# EAGLE design C64-Wifi_UserP (EAGLE 9.2.2)
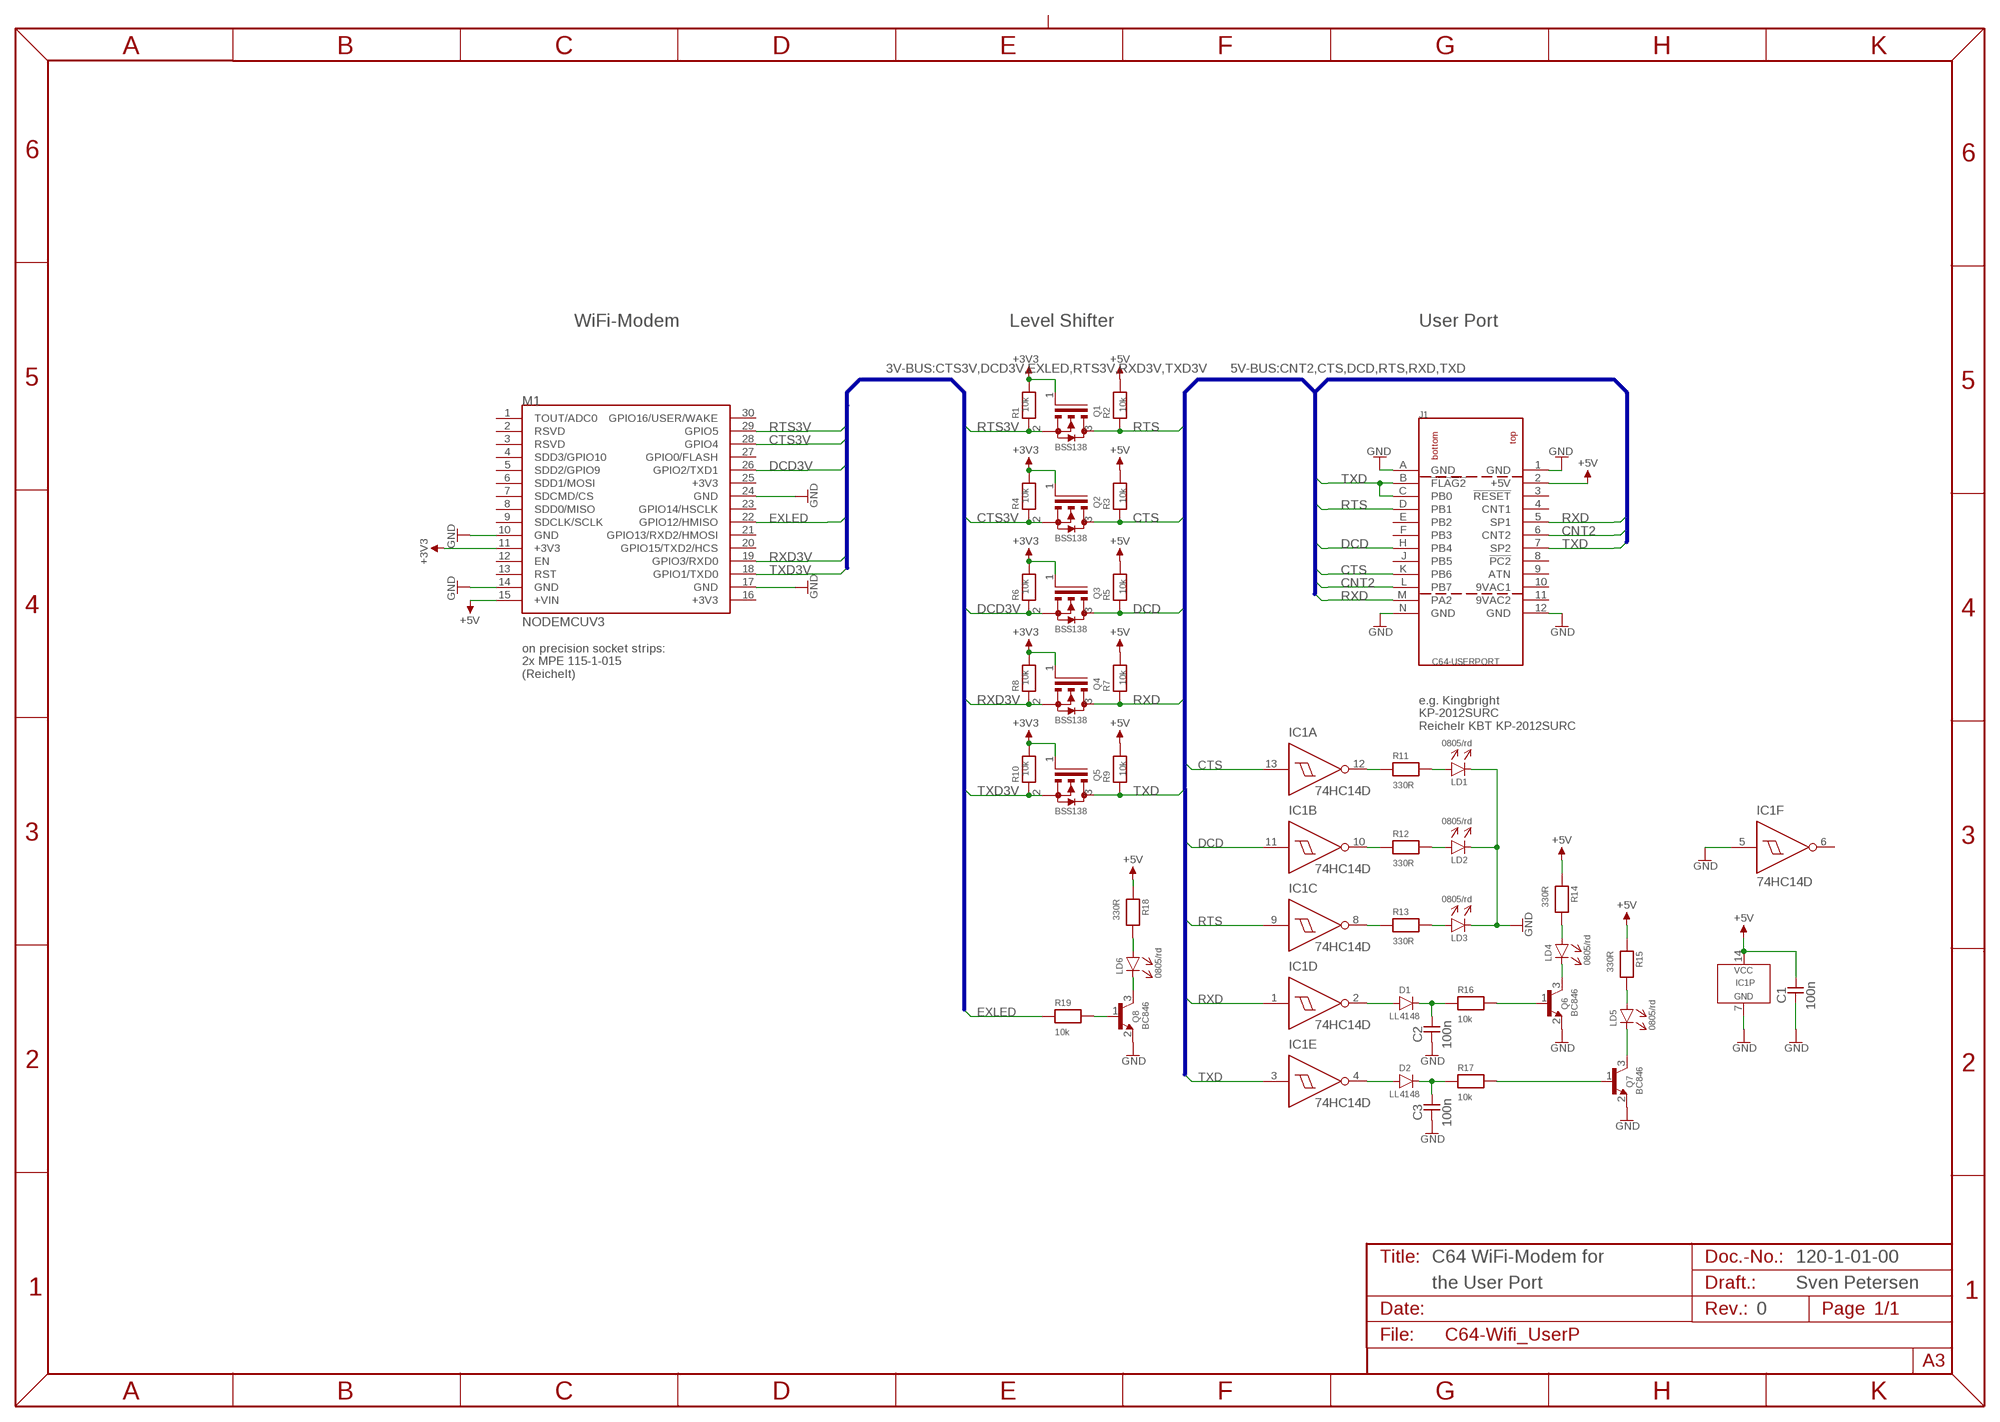
[diagram p0: schematic, sheet 1]

## Parts
C1  100n  C-0805  [0805]
C2  100n  C-0805  [0805]
C3  100n  C-0805  [0805]
D1  LL4148  [SOD80C]
D2  LL4148  [SOD80C]
IC1  74HC14D  7414  [SO-14]
J1  C64-USERPORT  [USERPORT]
LD1  0805/rd  0805-LED  [0805]
LD2  0805/rd  0805-LED  [0805]
LD3  0805/rd  0805-LED  [0805]
LD4  0805/rd  0805-LED  [0805]
LD5  0805/rd  0805-LED  [0805]
LD6  0805/rd  0805-LED  [0805]
M1  NODEMCUV3  [NODEMCUV3]
Q1  BSS138  [SOT23]
Q2  BSS138  [SOT23]
Q3  BSS138  [SOT23]
Q4  BSS138  [SOT23]
Q5  BSS138  [SOT23]
Q6  BC846  [SOT23]
Q7  BC846  [SOT23]
Q8  BC846  [SOT23]
R1  10k  R-0805  [0805]
R2  10k  R-0805  [0805]
R3  10k  R-0805  [0805]
R4  10k  R-0805  [0805]
R5  10k  R-0805  [0805]
R6  10k  R-0805  [0805]
R7  10k  R-0805  [0805]
R8  10k  R-0805  [0805]
R9  10k  R-0805  [0805]
R10  10k  R-0805  [0805]
R11  330R  R-0805  [0805]
R12  330R  R-0805  [0805]
R13  330R  R-0805  [0805]
R14  330R  R-0805  [0805]
R15  330R  R-0805  [0805]
R16  10k  R-0805  [0805]
R17  10k  R-0805  [0805]
R18  330R  R-0805  [0805]
R19  10k  R-0805  [0805]

## Nets
+3V3: M1.11(+3V3) Q1.1(G) Q2.1(G) Q3.1(G) Q4.1(G) Q5.1(G) R1.2 R4.2 R6.2 R8.2 R10.2
+5V: C1.2 IC1.14(P:VCC) J1.2(+5V) M1.15(+VIN) R2.2 R3.2 R5.2 R7.2 R9.2 R14.1 R15.1 R18.1
CNT2: J1.6(CNT2) J1.L(PB7)
CTS: IC1.13(A:I) J1.K(PB6) Q2.3(D) R3.1
CTS3V: M1.28(GPIO4) Q2.2(S) R4.1
DCD: IC1.11(B:I) J1.H(PB4) Q3.3(D) R5.1
DCD3V: M1.26(GPIO2/TXD1) Q3.2(S) R6.1
EXLED: M1.22(GPIO12/HMISO) R19.1
GND: C1.1 C2.1 C3.1 IC1.5(F:I) IC1.7(P:GND) J1.1(GND) J1.12(GND) J1.A(GND) J1.N(GND) LD1.K LD2.K LD3.K M1.10(GND) M1.14(GND) M1.17(GND) M1.24(GND) Q6.2(E) Q7.2(E) Q8.2(E)
N$1: IC1.12(A:O) R11.1
N$2: IC1.10(B:O) R12.1
N$3: IC1.8(C:O) R13.1
N$4: D1.A IC1.2(D:O)
N$5: D2.A IC1.4(E:O)
N$6: LD5.A R15.2
N$7: LD4.A R14.2
N$8: LD3.A R13.2
N$9: LD2.A R12.2
N$10: LD1.A R11.2
N$11: C2.2 D1.K R16.1
N$12: C3.2 D2.K R17.1
N$13: Q6.1(B) R16.2
N$14: Q7.1(B) R17.2
N$15: LD4.K Q6.3(C)
N$16: LD5.K Q7.3(C)
N$17: LD6.A R18.2
N$18: LD6.K Q8.3(C)
N$19: Q8.1(B) R19.2
RTS: IC1.9(C:I) J1.D(PB1) Q1.3(D) R2.1
RTS3V: M1.29(GPIO5) Q1.2(S) R1.1
RXD: IC1.1(D:I) J1.5(SP1) J1.M(PA2) Q4.3(D) R7.1
RXD3V: M1.19(GPIO3/RXD0) Q4.2(S) R8.1
TXD: IC1.3(E:I) J1.7(SP2) J1.B(!FLAG2) J1.C(PB0) Q5.3(D) R9.1
TXD3V: M1.18(GPIO1/TXD0) Q5.2(S) R10.1
Unconnected: IC1.6(F:O) J1.3(!RESET) J1.4(CNT1) J1.8(!PC2) J1.9(ATN) J1.E(PB2) J1.F(PB3) J1.J(PB5) M1.1(TOUT/ADC0) M1.2(RSVD) M1.3(RSVD) M1.4(SDD3/GPIO10) M1.5(SDD2/GPIO9) M1.6(SDD1/MOSI) M1.7(SDCMD/CS) M1.8(SDD0/MISO) M1.9(SDCLK/SCLK) M1.12(EN) M1.13(RST) M1.16(+3V3) M1.20(GPIO15/TXD2/HCS) M1.21(GPIO13/RXD2/HMOSI) M1.23(GPIO14/HSCLK) M1.25(+3V3) M1.27(GPIO0/FLASH) M1.30(GPIO16/USER/WAKE)

## Buses
3V-BUS:CTS3V,DCD3V,EXLED,RTS3V,RXD3V,TXD3V
5V-BUS:CNT2,CTS,DCD,RTS,RXD,TXD

## Notes on the sheet
- WiFi-Modem | Level Shifter | User Port
- on precision socket strips:
  2x MPE 115-1-015
  (Reichelt)
- e.g. Kingbright
  KP-2012SURC
  Reichelr KBT KP-2012SURC
- C64 WiFi-Modem for | 120-1-01-00
- the User Port | Sven Petersen
- 0

## Power pins joined to a net without a drawn wire
9VAC1: J1.10(9VAC1)
9VAC2: J1.11(9VAC2)

## Library data of the parts
C1-C3 = SMD:C-0805
D1 D2 = Dioden:LL4148
IC1 = 74XX:7414
J1 = Commodore:C64-USERPORT
LD1-LD6 = LED:0805-LED
M1 = WeMos:NODEMCUV3
Q1-Q5 = Transistoren:BSS138
Q6-Q8 = Transistoren:BC846
R1-R19 = SMD:R-0805

## Board
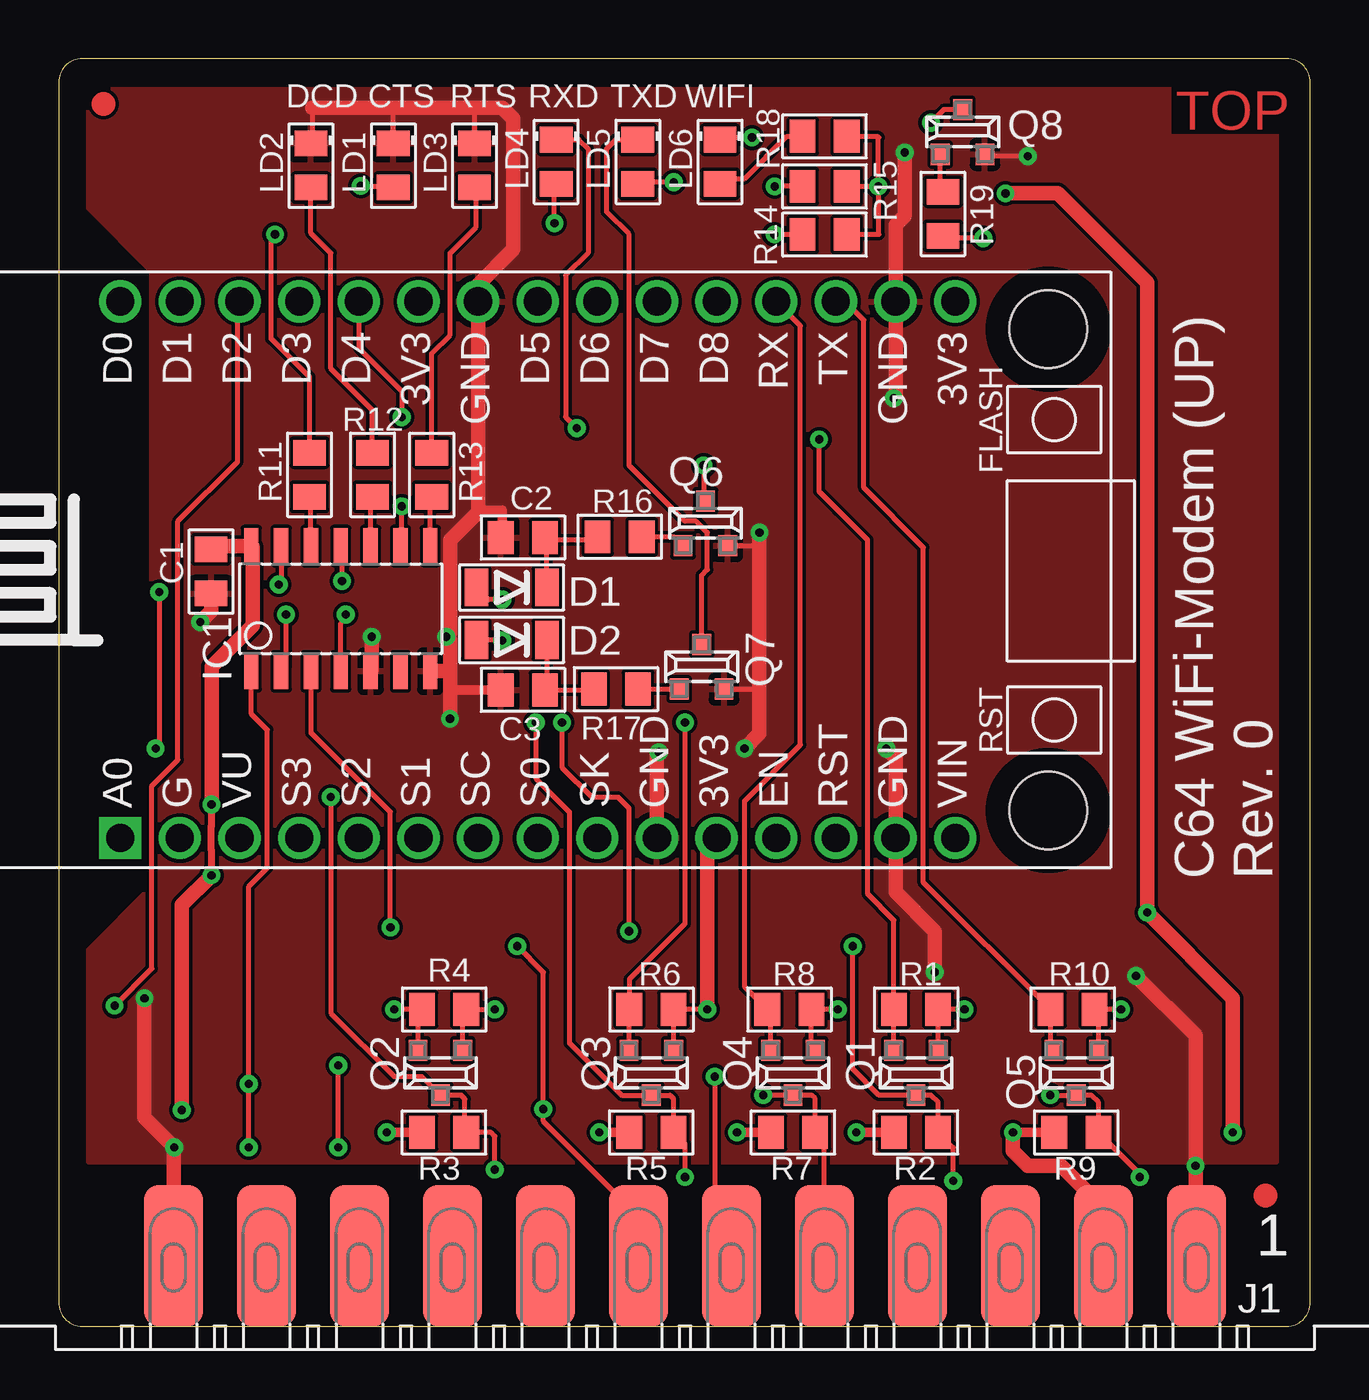
[diagram p1: board, top side]
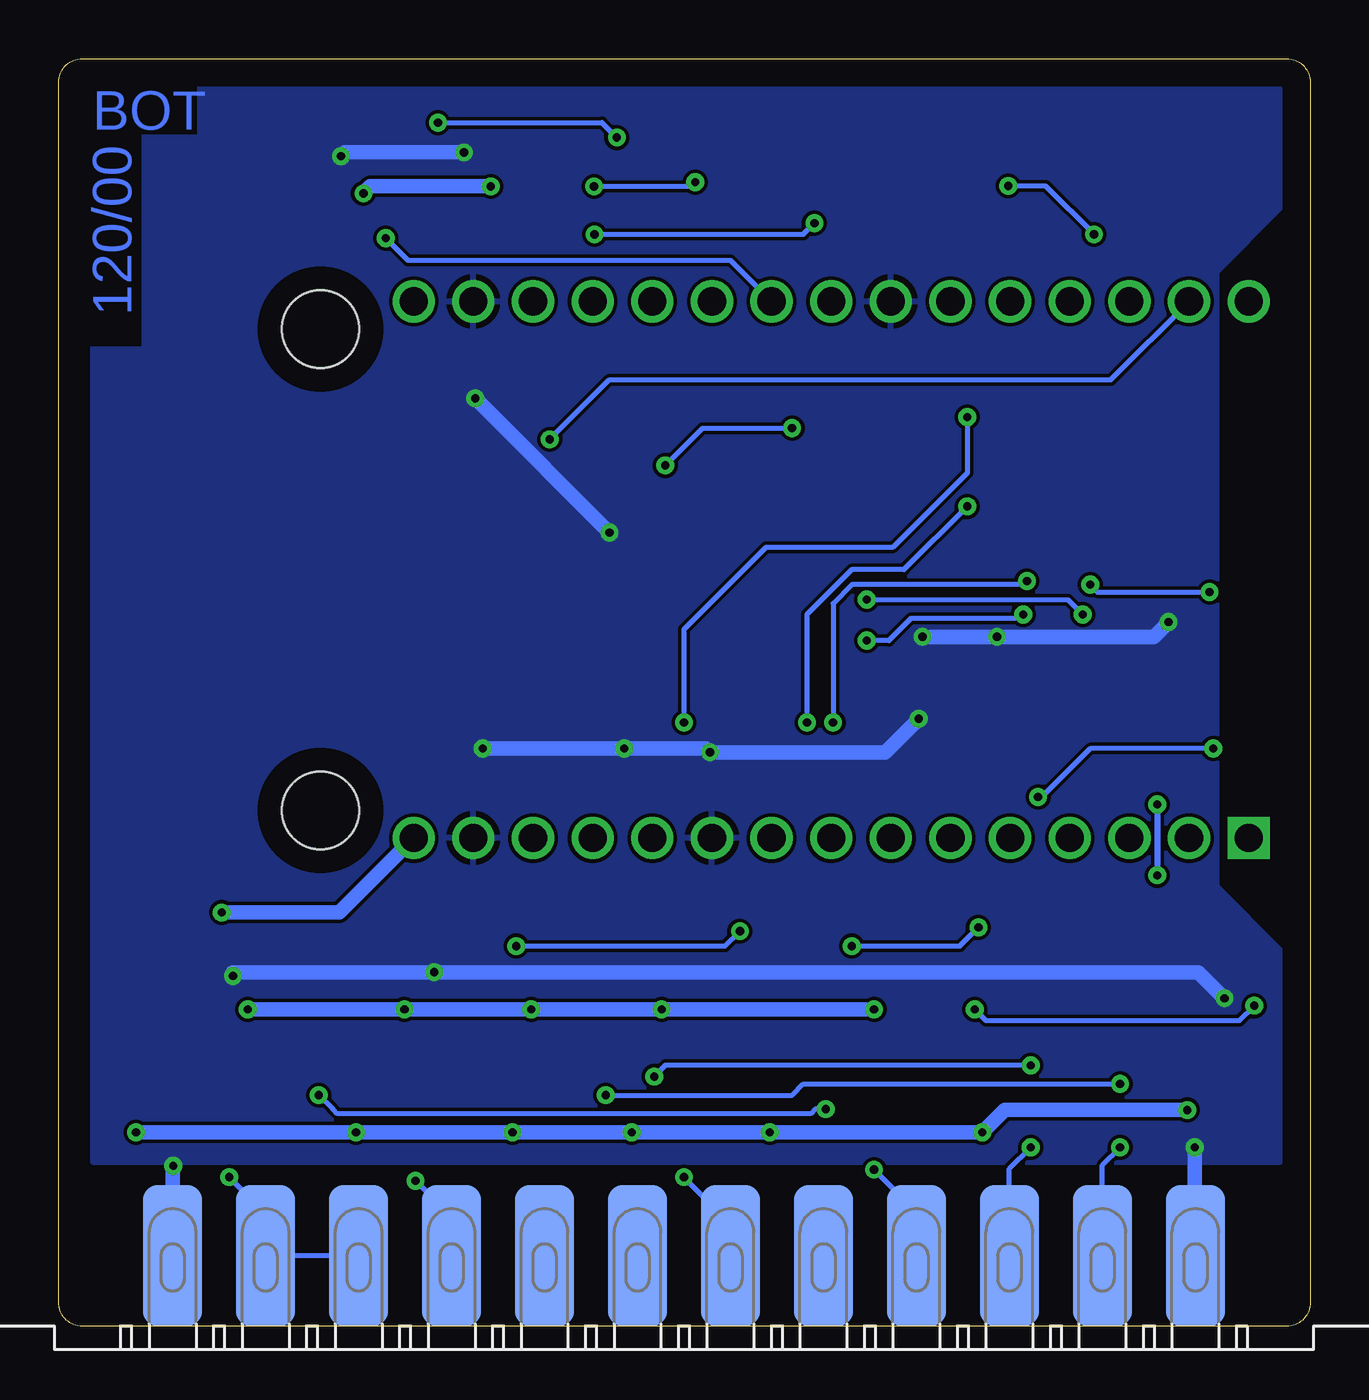
[diagram p2: board, bottom side, seen from below]

Size 53.3 x 54 mm. Coordinates in mm from the lower left corner, seen from the top.
Outline: 0,53 0,1 arc90 1,0 52.3,0 arc90 53.3,1 53.3,53 arc90 52.3,54 1,54 arc90 0,53
Copper layers (1*16): Top 0.035mm / dielectric 1.5mm / Bottom 0.035mm
Design rules "default *": minimum track width 6mil, minimum drill 0.35mm, track to track 6mil, track to pad 6mil, pad to pad 6mil, via to via 6mil, smd to smd 6mil, copper to edge 40mil, drill to drill 6mil, minimum pad ring 10mil, minimum via ring 8mil, stop-mask expansion 4mil, vias tented up to drill 24mil, thermal gap 10mil
bRestrict: 2 lines

### Footprints (pad centres in the part's own frame; a part is rotated, then mirrored left to right if it is on the bottom)
0805 = smd 1.092 x 1.397: 1 -0.94,0; 2 0.94,0
SOD80C = smd 1 x 1.6: A -1.5,0; K 1.5,0
SO-14 = smd 0.61 x 1.524: 1 -3.81,-2.667; 2 -2.54,-2.667; 3 -1.27,-2.667; 4 0,-2.667; 5 1.27,-2.667; 6 2.54,-2.667; 7 3.81,-2.667; 8 3.81,2.667; 9 2.54,2.667; 10 1.27,2.667; 11 0,2.667; 12 -1.27,2.667; 13 -2.54,2.667; 14 -3.81,2.667
USERPORT = smd 2.5 x 6: 1 -21.78,-3; 2 -17.82,-3; 3 -13.86,-3; 4 -9.9,-3; 5 -5.94,-3; 6 -1.98,-3; 7 1.98,-3; 8 5.94,-3; 9 9.9,-3; 10 13.86,-3; 11 17.82,-3; 12 21.78,-3 | smd 2.5 x 6 bottom: A -21.78,-3; B -17.82,-3; C -13.86,-3; D -9.9,-3; E -5.94,-3; F -1.98,-3; H 1.98,-3; J 5.94,-3; K 9.9,-3; L 13.86,-3; M 17.82,-3; N 21.78,-3
0805' = smd 1.092 x 1.397: A -0.94,0; K 0.94,0
NODEMCUV3 = drill 1.2 square: 1 -11.43,17.78 | drill 1.2: 2 -11.43,15.24; 3 -11.43,12.7; 4 -11.43,10.16; 5 -11.43,7.62; 6 -11.43,5.08; 7 -11.43,2.54; 8 -11.43,0; 9 -11.43,-2.54; 10 -11.43,-5.08; 11 -11.43,-7.62; 12 -11.43,-10.16; 13 -11.43,-12.7; 14 -11.43,-15.24; 15 -11.43,-17.78; 16 11.43,-17.78; 17 11.43,-15.24; 18 11.43,-12.7; 19 11.43,-10.16; 20 11.43,-7.62; 21 11.43,-5.08; 22 11.43,-2.54; 23 11.43,0; 24 11.43,2.54; 25 11.43,5.08; 26 11.43,7.62; 27 11.43,10.16; 28 11.43,12.7; 29 11.43,15.24; 30 11.43,17.78 | hole 3.3: -10.25,-21.75; 10.25,-21.75
SOT23 = smd 0.8 x 0.9: 1 -0.953,-0.953; 2 0.953,-0.953; 3 0,0.953

### Placement (x,y rotation side)
C1  6.49,32.16 90 top
C2  19.77,33.6 0 top
C3  19.77,27.11 0 top
D1  19.29,31.47 0 top
D2  19.29,29.23 0 top
IC1  12.01,30.57 0 top
J1  26.67,0 180 top
LD1  0805/rd  [0805']  14.25,49.45 90 top
LD2  0805/rd  [0805']  10.74,49.45 90 top
LD3  0805/rd  [0805']  17.71,49.45 90 top
LD4  0805/rd  [0805']  21.19,49.61 90 top
LD5  0805/rd  [0805']  24.66,49.61 90 top
LD6  0805/rd  [0805']  28.17,49.61 90 top
M1  20.4,32.23 90 top
Q1  36.51,10.79 180 top
Q2  16.26,10.79 180 top
Q3  25.24,10.79 180 top
Q4  31.27,10.79 180 top
Q5  43.34,10.79 180 top
Q6  27.54,34.2 0 top
Q7  27.39,28.09 0 top
Q8  38.5,50.88 0 top
R1  36.51,13.49 0 top
R2  36.51,8.26 180 top
R3  16.41,8.26 180 top
R4  16.41,13.49 0 top
R5  25.24,8.26 180 top
R6  25.24,13.49 0 top
R7  31.27,8.26 180 top
R8  31.11,13.49 0 top
R9  43.34,8.26 180 top
R10  43.18,13.49 0 top
R11  10.68,36.27 90 top
R12  13.36,36.27 90 top
R13  15.89,36.27 90 top
R14  32.62,46.51 180 top
R15  32.62,48.56 180 top
R16  23.89,33.63 0 top
R17  23.73,27.14 0 top
R18  32.62,50.69 180 top
R19  37.66,47.39 90 top
U$36  [PCB-TITLE/]  0,67.15 0 top  (outside the outline)
U$37  [2LAYER]  47.58,50.96 0 top
U$38  [SMD_REF_R1MM]  1.91,52.07 0 top
U$39  [SMD_REF_R1MM]  51.39,5.56 0 top

### Tracks (layer width: path | path; a pad name or v marks a point on that pad's centre or on a via)
+3V3  (via drill 0.35)
  Top 0.203: Q2.1 17.21,13.35 R4.2 v18.57,13.49 | v27.62,13.49 R6.2 26.19,13.48 Q3.1 | Q4.1 32.05,11.92 R8.2 v33.18,13.49 | v38.58,13.49 R1.2 37.47,13.48 Q1.1 | v45.24,13.49 44.29,13.49 | 44.29,13.49 R10.2 | Q5.1 44.29,13.49
  Top 0.61: v27.62,13.49 27.62,20.4 M1.11
  Bottom 0.61: v18.57,13.49 v27.62,13.49 v33.18,13.49 v38.58,13.49 v45.24,13.49
+5V  (via drill 0.35)
  Top 0.203: R18.1 34.87,50.69 34.92,50.64 34.91,50.62 v34.91,48.56 | R15.1 v34.91,48.56 | R14.1 34.92,46.51 34.92,48.54 v34.91,48.56 | 34.92,48.58 v34.91,48.56
  Top 0.305: v6.51,19.21 6.51,20.28 6.5,20.3 6.5,21.3 6.51,21.31 v6.51,22.23
  Top 0.406: v40.64,8.26 R9.2 | v33.97,8.26 R2.2 | v28.89,8.26 R7.2 | v23.02,8.26 R5.2 | v13.97,8.26 R3.2
  Top 0.61: J1.2 44.49,5.04 42.7,6.83 41.27,6.83 40.64,7.46 v40.64,8.26 | v5.24,9.21 5.24,17.94 v6.51,19.21 | v6.51,22.23 6.51,28.1 8.26,29.84 8.26,33.19 IC1.14 6.63,33.24 C1.2 | v40.32,48.26 42.55,48.26 46.35,44.45 v46.35,17.62 50.01,13.97 v50.01,8.26
  Bottom 0.254: v6.51,22.23 v6.51,19.21
  Bottom 0.61: v5.24,9.21 13.02,9.21 v13.97,8.26 v23.02,8.26 v28.89,8.26 v33.97,8.26 v40.64,8.26 v50.01,8.26 | v34.91,48.56 40.02,48.56 v40.32,48.26 | M1.15 41.35,17.62 v46.35,17.62
CNT2  (via drill 0.35)
  Top 0.203: v11.91,7.62 v11.91,11.11 | v27.94,10.64 27.94,3.71 J1.6
  Bottom 0.203: J1.L 12.81,6.72 v11.91,7.62 | v11.91,11.11 27.46,11.11 v27.94,10.64
CTS  (via drill 0.35)
  Top 0.203: v18.57,6.67 18.57,8.1 18.41,8.26 R3.1 17.3,8.31 17.3,9.68 17.14,9.84 Q2.3 15.46,10.64 14.29,10.64 11.59,13.34 v11.59,22.54 | IC1.13 9.47,31.7 v9.37,31.59 | v4.29,31.27 4.29,24.77 v4.13,24.61
  Bottom 0.203: J1.K 16.77,4.86 v18.57,6.67 | v9.37,31.59 9.05,31.27 v4.29,31.27 | v4.13,24.61 9.37,24.61 11.43,22.54 v11.59,22.54
CTS3V  (via drill 0.35)
  Top 0.203: Q2.2 15.3,13.32 R4.1 v14.29,13.49 | v2.38,13.65 3.97,15.24 3.97,23.02 5.08,24.13 5.08,34.29 7.62,36.83 7.62,43.58 M1.28
  Bottom 0.203: v14.29,13.49 13.81,13.02 3.02,13.02 v2.38,13.65
DCD  (via drill 0.35)
  Top 0.203: Q3.3 25.4,9.84 | 25.4,9.84 26.04,9.84 26.19,9.68 26.18,9.67 R5.1 26.67,7.77 v26.67,6.35 | IC1.11 arc-90 12.06,33.19 v12.06,31.75 | v20.32,25.72 20.32,23.34 21.75,21.91 21.75,12.06 23.97,9.84 25.4,9.84
  Bottom 0.203: v26.67,6.35 24.69,4.37 J1.H | v12.06,31.75 arc90 12.22,31.59 19.53,31.59 20.32,30.8 v20.32,25.72
DCD3V  (via drill 0.35)
  Top 0.203: Q3.2 R6.1 24.3,14.78 26.67,17.14 v26.67,25.72 | M1.26 12.78,41.67 14.61,39.85 v14.61,38.73
  Bottom 0.203: v14.61,38.73 14.61,36.35 17.78,33.18 23.18,33.18 26.67,29.69 v26.67,25.72
EXLED  (via drill 0.35)
  Top 0.203: v39.37,46.35 37.75,46.35 R19.1
  Bottom 0.203: M1.22 24.69,45.4 38.42,45.4 v39.37,46.35 | v39.37,46.35 39.53,46.51 v39.37,46.35
GND  (via drill 0.35)
  Top 0.203: Q7.2 29.84,27.14 29.84,27.15 | Q6.2 29.76,33.25 29.84,33.34 | 10.79,51.91 10.79,50.44 LD2.K | LD1.K 14.25,51.88 14.29,51.91 | LD3.K 17.71,51.84 17.78,51.91 | v41.27,49.85 39.52,49.85 Q8.2
  Top 0.406: C3.1 16.71,27.11 16.67,27.15 | C2.1 18.89,33.67 18.89,34.77 17.94,34.77 17.86,34.69
  Top 0.61: J1.12 4.89,7.62 v4.92,7.62 3.65,8.89 v3.65,13.97 | J1.1 48.42,3.03 v48.42,6.83 48.42,12.38 v45.88,14.92 | C1.1 6.49,30.46 v6.03,30 | v13.34,29.37 13.34,27.96 IC1.5 | 16.67,27.94 16.67,29.21 v16.51,29.37 16.67,29.53 16.67,33.5 17.86,34.69 M1.24 17.86,44.37 19.37,45.88 19.37,51.44 18.89,51.91 17.78,51.91 14.29,51.91 10.79,51.91 | 16.67,27.94 16.67,27.15 v16.67,25.88 | IC1.7 16.63,27.9 16.67,27.94 | M1.10 25.48,24.37 v25.56,24.45 | v29.21,24.61 29.84,25.24 29.84,27.15 29.84,33.34 v29.84,33.81 | v35.56,39.53 35.64,39.61 M1.17 35.64,46.91 36.04,47.31 v36.04,50.01 | v35.24,24.61 35.64,24.21 M1.14 35.64,18.49 37.31,16.83 v37.31,15.08
  Bottom 0.61: v4.92,7.62 4.92,3 J1.12 | J1.1 48.45,6.79 v48.42,6.83 | v3.65,13.97 4.76,15.08 v37.31,15.08 45.88,15.08 v45.88,14.92 | v6.03,30 6.67,29.37 v13.34,29.37 v16.51,29.37 | v16.67,25.88 18.1,24.45 v25.56,24.45 25.72,24.61 v29.21,24.61 v35.24,24.61 | v29.84,33.81 35.24,39.21 v35.56,39.53 | v36.04,50.01 41.12,50.01 v41.27,49.85
  pour Bottom: 1.27,6.99 1.27,16.03 3.97,18.73 3.97,44.93 1.27,47.62 1.27,52.7 51.86,52.7 51.86,6.99
  pour Top: 1.27,6.99 1.27,16.03 3.97,18.73 3.97,44.93 1.27,47.62 1.27,52.7 51.86,52.7 51.86,6.99
N$1
  Top 0.203: IC1.12 10.74,35.27 R11.1
N$2
  Top 0.203: IC1.10 13.28,35.26 R12.1
N$3
  Top 0.203: IC1.8 15.82,35.27 R13.1
N$4  (via drill 0.35)
  Top 0.203: IC1.2 9.68,28.11 v9.68,30.32 | v18.89,30.96 18.3,30.96 D1.A
  Bottom 0.203: v9.68,30.32 10.32,30.96 v18.89,30.96
N$5  (via drill 0.35)
  Top 0.203: IC1.4 12.01,29.95 12.22,30.16 v12.22,30.32 | v18.89,29.21 18.87,29.23 D2.A
  Bottom 0.203: v12.22,30.32 12.38,30.16 16.99,30.16 17.94,29.21 v18.89,29.21
N$6  (via drill 0.35)
  Top 0.203: R15.2 v30.5,48.56 30.48,48.58 | v26.19,48.74 24.73,48.74 LD5.A
  Bottom 0.203: v30.5,48.56 26.37,48.56 v26.19,48.74
N$7  (via drill 0.35)
  Top 0.203: R14.2 v30.48,46.51 | v21.11,46.99 21.11,48.6 LD4.A
  Bottom 0.203: v30.48,46.51 21.59,46.51 v21.11,46.99
N$8
  Top 0.203: R13.2 15.89,41.45 16.67,42.23 16.67,45.72 17.78,46.83 17.78,48.44 LD3.A
N$9
  Top 0.203: R12.2 13.36,39.02 11.59,40.8 11.59,45.72 10.74,46.57 LD2.A
N$10  (via drill 0.35)
  Top 0.203: R11.2 10.68,40.44 9.05,42.07 9.05,46.35 v9.21,46.51 | v12.86,48.58 14.19,48.58 LD1.A
  Bottom 0.203: v9.21,46.51 11.27,48.58 v12.86,48.58
N$11
  Top 0.203: D1.K 20.79,33.52 | 20.79,33.52 C2.2 | 20.79,33.52 22.84,33.52 R16.1
N$12
  Top 0.203: D2.K 20.79,27.19 C3.2 22.76,27.11 R17.1
N$13
  Top 0.203: R16.2 26.21,33.63 Q6.1
N$14
  Top 0.203: R17.2 Q7.1
N$15  (via drill 0.35)
  Top 0.203: LD4.K 22.16,50.55 22.54,50.16 22.54,45.72 21.59,44.77 21.59,38.73 v22.07,38.26 | v27.46,36.67 27.46,35.24 Q6.3
  Bottom 0.203: v22.07,38.26 25.88,38.26 v27.46,36.67
N$16
  Top 0.203: Q7.3 27.39,31.99 27.62,32.23 27.62,33.81 27.15,34.29 26.67,34.29 24.29,36.67 24.29,46.51 23.34,47.47 23.34,50.16 23.72,50.55 LD5.K
N$17
  Top 0.203: LD6.A 28.39,48.9 29.21,48.9 31.01,50.69 R18.2
N$18  (via drill 0.35)
  Top 0.203: Q8.3 37.7,51.83 v37.15,51.28 | v29.53,50.64 28.26,50.64 LD6.K
  Bottom 0.203: v37.15,51.28 30.16,51.28 v29.53,50.64
N$19
  Top 0.203: R19.2 37.55,48.44 Q8.1
RTS  (via drill 0.35)
  Top 0.203: v38.1,6.19 38.1,7.61 R2.1 37.45,9.54 37.15,9.84 Q1.3 34.92,9.84 33.81,10.95 v33.81,16.19 | IC1.9 arc90 14.61,33.29 v14.61,34.92 | v21.43,25.72 21.43,23.81 22.7,22.54 23.81,22.54 24.29,22.07 v24.29,16.83
  Bottom 0.203: J1.D 36.57,4.66 v38.1,6.19 | v14.61,34.92 17.3,32.23 19.53,32.23 21.43,30.32 v21.43,25.72 | v33.81,16.19 24.92,16.19 v24.29,16.83
RTS3V  (via drill 0.35)
  Top 0.203: Q1.2 R1.1 35.57,17.29 34.45,18.41 34.45,33.5 33.18,34.77 32.38,35.56 v32.38,37.78 | v32.38,37.78 32.38,37.94 v32.38,37.78
  Bottom 0.203: v32.38,37.78 29.84,40.32 8.49,40.32 M1.29
RXD  (via drill 0.35)
  Top 0.203: J1.5 32.61,7.86 R7.1 32.21,9.7 32.07,9.84 Q4.3 v30,9.84 | v8.1,7.62 v8.1,10.32 8.1,18.73 8.89,19.53 8.89,25.4 8.2,26.09 IC1.1
  Bottom 0.203: J1.M 8.85,6.87 v8.1,7.62 | v30,9.84 22.07,9.84 21.59,10.32 v8.1,10.32
RXD3V
  Top 0.203: Q4.2 30.32,13.34 30,13.65 30.16,13.49 R8.1 29.21,14.46 29.21,22.38 31.59,24.77 31.59,42.62 M1.19
TXD  (via drill 0.35)
  Top 0.203: v46.04,6.35 46.04,6.5 R9.1 44.29,9.53 43.97,9.84 Q5.3 v42.23,9.84 | J1.7 24.69,4.68 20.64,8.73 v20.64,9.25 20.64,15.08 v19.53,16.19 | IC1.3 10.74,25.29 14.13,21.91 v14.13,16.99
  Bottom 0.203: v46.04,6.35 44.49,4.8 44.49,3.17 | 44.49,3.17 J1.B | v20.64,9.25 21.07,9.25 21.27,9.05 41.43,9.05 41.59,9.21 41.63,9.25 v42.23,9.84 | J1.C 44.31,3 44.49,3.17 | v19.53,16.19 14.92,16.19 v14.13,16.99
TXD3V
  Top 0.203: Q5.2 42.24,11.89 R10.1 36.83,18.9 36.83,33.18 34.29,35.72 34.29,42.86 33.5,43.66 M1.18

### Text on the board
Bottom: 120/00
tPlace: DCD | CTS | RTS | RXD | TXD | WIFI | C64 WiFi-Modem (UP) / Rev. 0
tNames: 1
Document: Sven Petersen | 120-2-01-00 | 2019 | 35µm | 2 | 0